# Altium schematic sheet Power.SchDoc
size A4
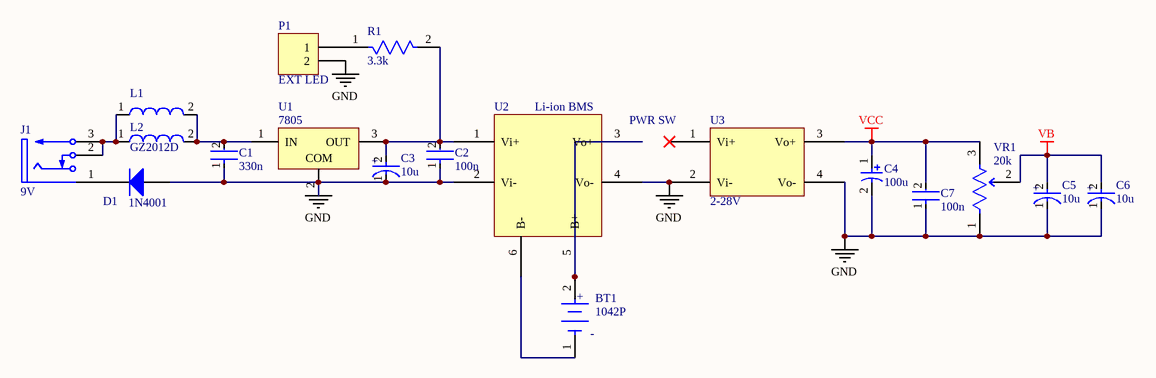
[diagram p0: Power.SchDoc]

## Parts
BT1  1042P  [FP-1042P-MFG]
C1  330n  [FP-CL10-IPC_A]
C2  100n  [FP-CL10-IPC_A]
C3  10u  [FP-TAJA-MFG]
C4  100u  [EL_5X11_RA]
C5  10u  [FP-TAJA-MFG]
C6  10u  [FP-TAJA-MFG]
C7  100n  [FP-CL10-IPC_A]
D1  1N4001  [DO-41]
J1  9V  [SWITCH-RAPC712X-3_V]
L1  GZ2012D  [SMD-0805]  (value not drawn)
L2  GZ2012D  [SMD-0805]
P1  EXT LED  [HDR1X2]
R1  3.3k  [FP-RT0805-MFG]
U1  7805  [TO-220_H]
U2  Li-ion BMS  [BMS]
U3  2-28V  [BOOST]
VR1  20k  [TRIM_6_TOP]

## Nets
GND: C1.1 C2.1 C3.1(C) C4.2 C5.1(C) C6.1(C) C7.1 D1.1(A) P1.2 U1.2(COM) U2.2(Vi-) U2.4(Vo-) U3.2(Vi-) U3.4(Vo-) VR1.1(CCW)
VB: C5.2(A) C6.2(A) VR1.2(WIPER)
VCC: C4.1 C7.2 U3.3(Vo+) VR1.3(CW)
NetBT1_1: BT1.1(C) U2.6(B-)
NetBT1_2: BT1.2(A) U2.3(Vo+) U2.5(B+)
NetC1_2: C1.2 L1.2 L2.2 U1.1(IN)
NetC2_2: C2.2 C3.2(A) R1.2 U1.3(OUT) U2.1(Vi+)
NetD1_2: D1.2(K) J1.1
NetJ1_2: J1.2 J1.3 L1.1 L2.1
NetP1_1: P1.1 R1.1

Not connected (* = marked no-connect by the designer): U3 1(Vi+)*

## Notes on the sheet
- PWR SW
- (in symbol CMP-1661-00004-2) +
- (in symbol CMP-19636-000019-1) +; -

## Library data of the parts
BT1 = CMP-19636-000019-1: BATTERY HOLDER 18650 SMD TAB; Number of Cells: 1; Max Operating Temperature: 145°C; Termination: SMD/SMT; Mount: Surface Mount; Min Operating Temperature: -50°C; Package Quantity: 200; Packaging: Tray; Lead Free: Lead Free
C1 C2 C7 = CMP-13271-004807-1: Cap Ceramic 1nF 50V C0G ±5% Pad SMD 0603 +125°C T/R; Temperature Coefficient: 300ppm/°C; Voltage Rating (DC): 50V; Length: 1.6mm; Width: 0.031inch; Series: CL; Case Code (Imperial): 0603; Voltage: 50V; Lead Free: Lead Free; Packaging: Tape and Reel; Dielectric: C0G; Material: Ceramic; Thickness: 0.035inch; Max Operating Temperature: 125°C; Package Quantity: 1; RoHS Compliant: Yes; Radiation Hardening: No; Capacitance: 1nF; Mount: Surface Mount; Voltage Rating: 50V; Height: 0.8mm; Tolerance: 5%; Min Operating Temperature: -55°C; Case Code (Metric): 1608; Case/Package: 0603; Depth: 0.8mm
C3 C5 C6 = CMP-1661-00004-2: 10uF 16V  ±10% 3Ω 1206  SMD Tantalum Capacitor; ESR (Equivalent Series Resistance): 3R; Leakage Current: 1.6uA; Dissipation Factor: 8%; Polarity: Polar; Length: 3.2mm; Features: General Purpose; Voltage Rating: 16V; Voltage: 16V; Mount: Surface Mount; Case/Package: 1206; Number of Pins: 2; Case Code (Metric): 3216; Radiation Hardening: No; Min Operating Temperature: -55°C; Case Code (Imperial): 1206; Height - Seated (Max): 0.071inch; Lead Free: Lead Free; Termination: SMD/SMT; Dielectric Material: Tantalum; Width: 1.6mm; Tolerance: 10%; Capacitance: 10uF; Lead Pitch: 1.1mm; Max Operating Temperature: 125°C; Voltage Rating (DC): 16V; Packaging: Tape and Reel; Package Quantity: 1; REACH SVHC: No SVHC; Depth: 1.6mm; Height: 1.6mm
C4 = CAP_POL
D1 = DIODE_SW
J1 = CMP-2000-05384-1: Power Jack, 5 A, 3-Pin THD, RoHS, Bulk; Manufacturer: Switchcraft; Current Rating: 5A; Plug/Mating Plug Diameter: 2.1mmID,5.5mmOD; Gender: Male; Mating Products: S765-ND / -CONNPLUGMINIPWR2CONDWHT/RED / S760K-ND / -CONNPOWERPLUGMINI.08"BLACK / SC1052-ND / -CONNPOWERPLUGMINIBLACK; Number of Positions/Contacts: 2Conductors,2Contacts; Internal Switch(s): SingleSwitch,NormallyClosed; Shielding: Unshielded; Catalog Drawings: RAPC7(1,2)2XSide / RAPC7(1,2)2XTop; Dynamic Catalog: SwitchcraftInc; Other Names: Q2287470A / RAPC722X-ND / SC1313; Standard Package: 2,500; Termination: SolderEyelet(s); Family: Barrel-PowerConnectors; Housing Color: Black; Housing Material: Thermoplastic; RoHS Information: SwitchcraftRoHSInfo; Color: Black; Contact Material - Plating: Nickel; Mounting Type: ThroughHole,RightAngle; Manufacturer URL: http://www.switchcraft.com/; Contact Material: Brass; Datasheet Version: Rev. A, 08/2005; Connector Type: Jack; Category: Connectors,Interconnects; Datasheet URL: http://www.mouser.com/ds/2/393/rapc722x_cd-371352.pdf
L1 L2 = CMP-0220-00037-1: SMD EMI Suppression Ferrite Bead WE-CBF, Z = 1000 Ohm; ComponentLink2Description: Datasheet; PackageVersion: 2005; ComponentLink1URL: http://www.we-online.com; PackageDescription: Chip Inductor, 2-Leads, Body 2.0 x 1.2 mm; DatasheetVersion: Dec-2005; ComponentLink1Description: Manufacturer Link; Impedance: 1000 Ohm; PackageReference: SMD-0805; ComponentLink2URL: http://www.we-online.de/katalog/media/pdf/74279205.pdf
P1 = Header 2: Header, 2-Pin; LatestRevisionDate: 17-Jul-2002; LatestRevisionNote: Re-released for DXP Platform.; Publisher: Altium Limited
R1 = CMP-2001-01759-2: RES SMD 10K OHM 0.1% 1/8W 0805; Manufacturer Part Number: RT0805BRE0710KL; Manufacturer: Yageo; Voltage Rating: 150V; Resistance: 10KΩ; Tolerance: 0.0025; Temperature Coefficient: 50 ppm/°C; Power Rating: 0.125W; Value: 10KΩ; Temperature Range Low: -55°C; Device Class L2: Resistors; RoHS: TRUE; Series: RT; Device Class L1: Passive Components; Ipc Land Pattern Name: RESC200125X50; Category: Res; Automotive: No; ComponentLink2Description: Datasheet; ComponentLink2URL: http://www.yageo.com/documents/recent/PYu-RT_1-to-0.01_RoHS_L_9.pdf; Digikey Description: RES SMD 10K OHM 0.1% 1/8W 0805; Package: RT0805; Device Class L3: Chip SMD Resistors; Octopart: https://octopart.com/rt0805bre0710kl-yageo-1239246; Temperature Range High: +155°C; Lead Free: Yes; Height: 0.6mm; Composition: Thin Film; Footprint Url: http://www.yageo.com/exep/pages/download/literatures/PYu-R_Mount_10.pdf; Temperature: -55°C to +155°C; Mouser Description: Thin Film Resistors 10K ohm 0.1% 1/8W
U2 = BMS
U3 = BOOST
VR1 = TRIM